# Altium project Function Generator 2.PrjPcb
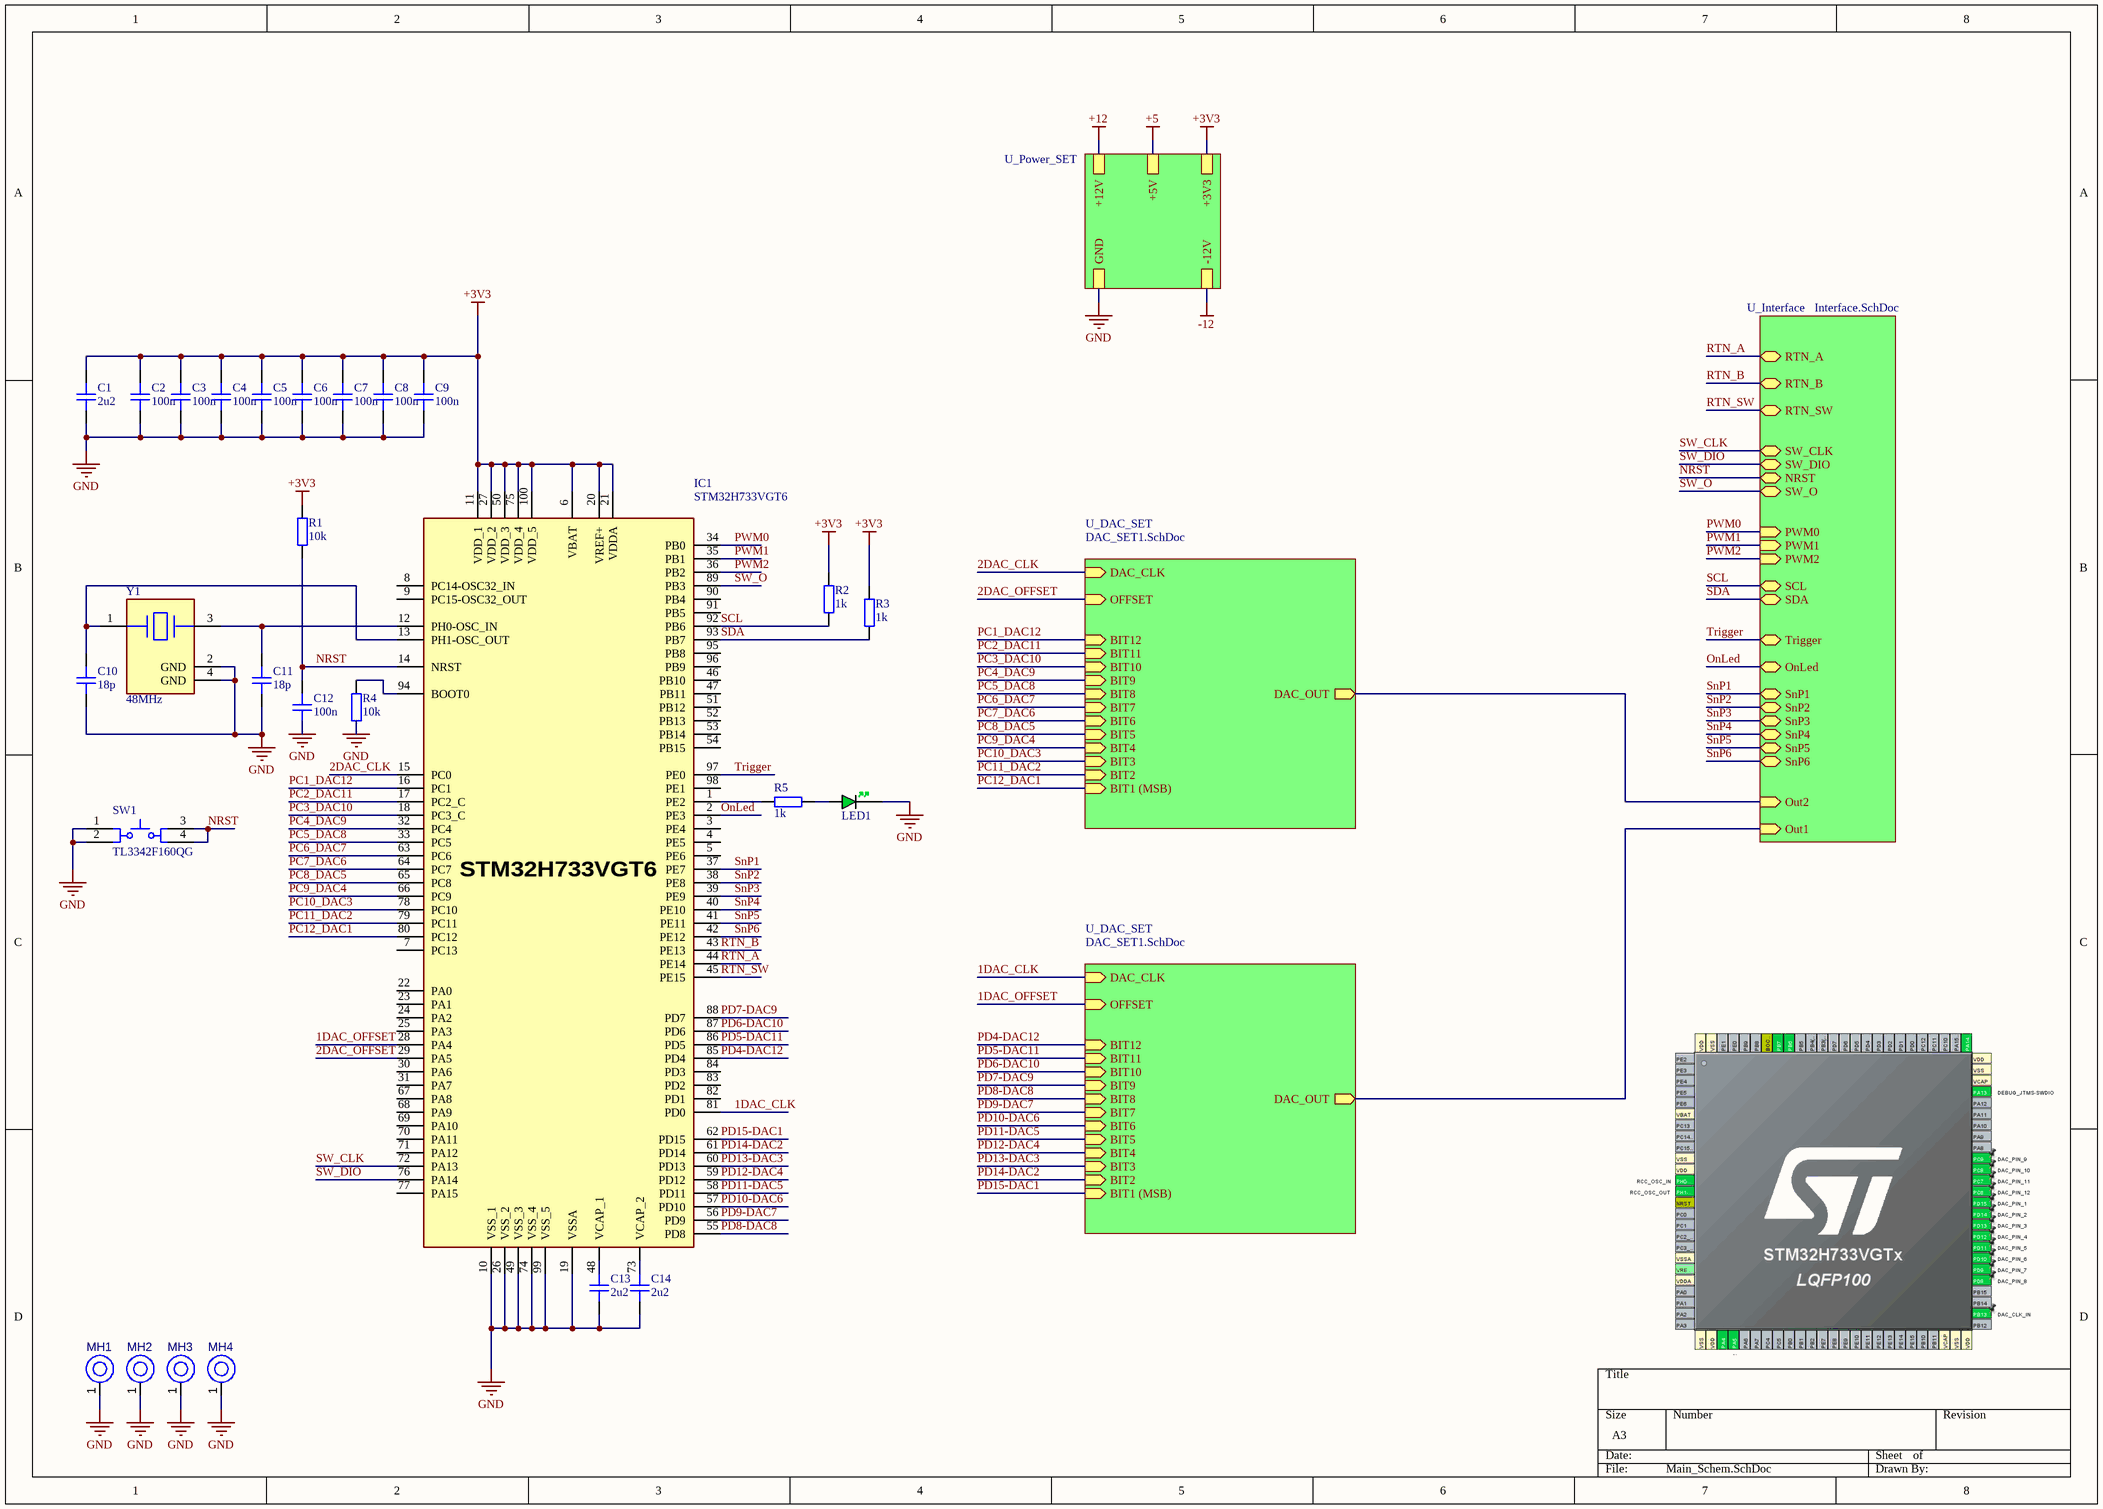
[diagram p0: Main_Schem.SchDoc]
4 sheets, 126 parts. Net scope: hierarchical (ports join the sheet entries above them; power ports are global).
Board file: PCB1.PcbDoc
Sheets:
  Main_Schem.SchDoc
    U_Power_SET = Power_SET.SchDoc
    U_DAC_SET = DAC_SET1.SchDoc
    U_Interface = Interface.SchDoc
    U_DAC_SET = DAC_SET1.SchDoc

## Sheet Main_Schem.SchDoc
size A3; SheetNumber: 1; SheetTotal: 4

### Parts
C1  2u2  [CAP_1206]
C2  100n  [CAP_0805]
C3  100n  [CAP_0805]
C4  100n  [CAP_0805]
C5  100n  [CAP_0805]
C6  100n  [CAP_0805]
C7  100n  [CAP_0805]
C8  100n  [CAP_0805]
C9  100n  [CAP_0805]
C10  18p  [CAP_0805]
C11  18p  [CAP_0805]
C12  100n  [CAP_0805]
C13  2u2  [CAP_1206]
C14  2u2  [CAP_1206]
IC1  STM32H733VGT6  [QFP50P1600X1600X160-100N]
LED1  GREEN  [LED_0805_GREEN]  (value not drawn)
R1  10k  [RES_0805]
R2  1k  [RES_0805]
R3  1k  [RES_0805]
R4  10k  [RES_0805]
R5  1k  [RES_0805]
SW1  TL3342F160QG  [ESWI-TL3342F160QG_V]
Y1  48MHz  [FP-ABM8-MFG]
ΜΗ1  PTH-M2D5X5  [PTH-M2D5X5]  (value not drawn)
ΜΗ2  PTH-M2D5X5  [PTH-M2D5X5]  (value not drawn)
ΜΗ3  PTH-M2D5X5  [PTH-M2D5X5]  (value not drawn)
ΜΗ4  PTH-M2D5X5  [PTH-M2D5X5]  (value not drawn)

### Sub-sheets
U_DAC_SET = DAC_SET1.SchDoc: BIT1 (MSB) (in), BIT2 (in), BIT3 (in), BIT4 (in), BIT5 (in), BIT6 (in), BIT7 (in), BIT8 (in), BIT9 (in), BIT10 (in), BIT11 (in), BIT12 (in), OFFSET (in), DAC_OUT (out), DAC_CLK (in)
U_DAC_SET = DAC_SET1.SchDoc: BIT1 (MSB) (in), BIT2 (in), BIT3 (in), BIT4 (in), BIT5 (in), BIT6 (in), BIT7 (in), BIT8 (in), BIT9 (in), BIT10 (in), BIT11 (in), BIT12 (in), OFFSET (in), DAC_OUT (out), DAC_CLK (in)
U_Interface = Interface.SchDoc: OnLed (bidir), Out1 (in), SnP1 (bidir), SnP2 (bidir), SnP3 (bidir), SnP4 (bidir), SnP5 (bidir), SnP6 (bidir), Trigger (bidir), SDA (bidir), SCL (bidir), Out2 (in), PWM0 (in), PWM1 (in), PWM2 (in), SW_CLK (bidir), SW_DIO (bidir), RTN_SW (bidir), RTN_B (bidir), RTN_A (bidir), NRST (bidir), SW_O (bidir)
U_Power_SET = Power_SET.SchDoc: +12V, -12V, +5V, +3V3, GND

### Nets
+3V3: C1.2 C2.2 C3.2 C4.2 C5.2 C6.2 C7.2 C8.2 C9.2 IC1.6(VBAT) IC1.11(VDD_1) IC1.20(VREF+) IC1.21(VDDA) IC1.27(VDD_2) IC1.50(VDD_3) IC1.75(VDD_4) IC1.100(VDD_5) R1.2 R2.1 R3.1 ; sheet U_Power_SET/+3V3
GND: C1.1 C2.1 C3.1 C4.1 C5.1 C6.1 C7.1 C8.1 C9.1 C10.1 C11.1 C12.1 C13.1 C14.1 IC1.10(VSS_1) IC1.19(VSSA) IC1.26(VSS_2) IC1.49(VSS_3) IC1.74(VSS_4) IC1.99(VSS_5) LED1.K R4.1 SW1.1 SW1.2 Y1.2(GND) Y1.4(GND) ΜΗ1.1(H1) ΜΗ2.1(H1) ΜΗ3.1(H1) ΜΗ4.1(H1) ; sheet U_Power_SET/GND
1DAC_CLK: IC1.81(PD0) ; sheet U_DAC_SET/DAC_CLK
1DAC_OFFSET: IC1.28(PA4) ; sheet U_DAC_SET/OFFSET
2DAC_CLK: IC1.15(PC0) ; sheet U_DAC_SET/DAC_CLK
2DAC_OFFSET: IC1.29(PA5) ; sheet U_DAC_SET/OFFSET
NRST: C12.2 IC1.14(NRST) R1.1 SW1.3 SW1.4 ; sheet U_Interface/NRST
OnLed: IC1.2(PE3) ; sheet U_Interface/OnLed  [project net LedON]
Out1: sheet U_DAC_SET/DAC_OUT, sheet U_Interface/Out1
Out2: sheet U_Interface/Out2, sheet U_DAC_SET/DAC_OUT
PC1_DAC12: IC1.16(PC1) ; sheet U_DAC_SET/BIT12
PC2_DAC11: IC1.17(PC2_C) ; sheet U_DAC_SET/BIT11
PC3_DAC10: IC1.18(PC3_C) ; sheet U_DAC_SET/BIT10
PC4_DAC9: IC1.32(PC4) ; sheet U_DAC_SET/BIT9
PC5_DAC8: IC1.33(PC5) ; sheet U_DAC_SET/BIT8
PC6_DAC7: IC1.63(PC6) ; sheet U_DAC_SET/BIT7
PC7_DAC6: IC1.64(PC7) ; sheet U_DAC_SET/BIT6
PC8_DAC5: IC1.65(PC8) ; sheet U_DAC_SET/BIT5
PC9_DAC4: IC1.66(PC9) ; sheet U_DAC_SET/BIT4
PC10_DAC3: IC1.78(PC10) ; sheet U_DAC_SET/BIT3
PC11_DAC2: IC1.79(PC11) ; sheet U_DAC_SET/BIT2
PC12_DAC1: IC1.80(PC12) ; sheet U_DAC_SET/BIT1 (MSB)
PD4-DAC12: IC1.85(PD4) ; sheet U_DAC_SET/BIT12
PD5-DAC11: IC1.86(PD5) ; sheet U_DAC_SET/BIT11
PD6-DAC10: IC1.87(PD6) ; sheet U_DAC_SET/BIT10
PD7-DAC9: IC1.88(PD7) ; sheet U_DAC_SET/BIT9
PD8-DAC8: IC1.55(PD8) ; sheet U_DAC_SET/BIT8
PD9-DAC7: IC1.56(PD9) ; sheet U_DAC_SET/BIT7
PD10-DAC6: IC1.57(PD10) ; sheet U_DAC_SET/BIT6
PD11-DAC5: IC1.58(PD11) ; sheet U_DAC_SET/BIT5
PD12-DAC4: IC1.59(PD12) ; sheet U_DAC_SET/BIT4
PD13-DAC3: IC1.60(PD13) ; sheet U_DAC_SET/BIT3
PD14-DAC2: IC1.61(PD14) ; sheet U_DAC_SET/BIT2
PD15-DAC1: IC1.62(PD15) ; sheet U_DAC_SET/BIT1 (MSB)
PWM0: IC1.34(PB0) ; sheet U_Interface/PWM0
PWM1: IC1.35(PB1) ; sheet U_Interface/PWM1
PWM2: IC1.36(PB2) ; sheet U_Interface/PWM2
RTN_A: IC1.44(PE14) ; sheet U_Interface/RTN_A
RTN_B: IC1.43(PE13) ; sheet U_Interface/RTN_B
RTN_SW: IC1.45(PE15) ; sheet U_Interface/RTN_SW
SCL: IC1.92(PB6) R2.2 ; sheet U_Interface/SCL
SDA: IC1.93(PB7) R3.2 ; sheet U_Interface/SDA
SnP1: IC1.37(PE7) ; sheet U_Interface/SnP1
SnP2: IC1.38(PE8) ; sheet U_Interface/SnP2
SnP3: IC1.39(PE9) ; sheet U_Interface/SnP3
SnP4: IC1.40(PE10) ; sheet U_Interface/SnP4
SnP5: IC1.41(PE11) ; sheet U_Interface/SnP5
SnP6: IC1.42(PE12) ; sheet U_Interface/SnP6
SW_CLK: IC1.72(PA13) ; sheet U_Interface/SW_CLK
SW_DIO: IC1.76(PA14) ; sheet U_Interface/SW_DIO
SW_O: IC1.89(PB3) ; sheet U_Interface/SW_O
Trigger: IC1.97(PE0) ; sheet U_Interface/Trigger
NetC10_2: C10.2 IC1.13(PH1-OSC_OUT) Y1.1
NetC11_2: C11.2 IC1.12(PH0-OSC_IN) Y1.3
NetC13_2: C13.2 IC1.48(VCAP_1)
NetC14_2: C14.2 IC1.73(VCAP_2)
NetIC1_1: IC1.1(PE2) R5.2
NetIC1_94: IC1.94(BOOT0) R4.2
NetLED1_A: LED1.A R5.1

Not connected (* = marked no-connect by the designer): IC1 3(PE4) 4(PE5) 5(PE6) 7(PC13) 8(PC14-OSC32_IN) 9(PC15-OSC32_OUT) 22(PA0) 23(PA1) 24(PA2) 25(PA3) 30(PA6) 31(PA7) 46(PB10) 47(PB11) 51(PB12) 52(PB13) 53(PB14) 54(PB15) 67(PA8) 68(PA9) 69(PA10) 70(PA11) 71(PA12) 77(PA15) 82(PD1) 83(PD2) 84(PD3) 90(PB4) 91(PB5) 95(PB8) 96(PB9) 98(PE1)

### Library data of the parts
C1 C13 C14 = CAP_1206: Capacitor SMD 1206; Manufacturer: *; Manufacturer Part Number: *; Distributor Link: *; LCSC: *; Rating: *; Dielectric: *
C2-C12 = CAP_0805: Capacitor SMD 0805; Manufacturer: *; Manufacturer Part Number: *; Distributor Link: *; LCSC: *; Rating: *; Dielectric: *
IC1 = CMP-020-00025-4: (550MHz), DAC
LED1 = LED_0805_GREEN: LED 0805 GREEN SMD; Manufacturer: *; Manufacturer Part Number: *; Distributor Link: *; LCSC: *
R1-R5 = RES_0805: Resistor SMD 0805; Manufacturer: *; Manufacturer Part Number: *; Distributor Link: *; LCSC: *
SW1 = CMP-011-00008-2: Tactile Switch, SPST-NO, 50 mA, 12 V, 4-Pin SMD, RoHS, Tape and Reel; Manufacturer: E-Switch; Operating Force: 1.6N; Current Rating: 50mA; Throw Configuration: SPST; Max Voltage Rating (DC): 12V; Datasheet URL: http://spec_sheets.e-switch.com/specs/P010632.pdf; Manufacturer URL: http://www.e-switch.ch/en/; Mounting Technology: SM; Case/Package: TL3342F160QG; Package Quantity: 3000; Contact Material: Silver; Package Description: 4-Pin Surface Mount Device, Body 5 x 5 mm, Pitch 6.3 mm; Package Reference: TL3342F160QG; Datasheet Version: Rev. I, 12/2010; Voltage Rating (DC): 12V; Contact Plating: Silver; RoHS Compliant: True; Packaging: TapeandReel
Y1 = CMP-27762-011708-1: Crystal 48MHz ±20ppm 18pF SMD-4 3.2mm x 2.5mm / ABM8-48.000MHZ-B2-T; Series Resistance: 35R; Frequency Stability: 50ppm; Package Quantity: 1000; Packaging: Tape and Reel; Mount: Surface Mount; Length: 3.2mm; Load Capacitance: 18pF; Max Operating Temperature: 70°C; Operating Frequency: 48 MHz; RoHS Compliant: Yes; Series: ABM8; Frequency Tolerance: 20ppm; Lead Free: Lead Free; Min Operating Temperature: -20°C; Case/Package: CSMD; Number of Pins: 4; Height: 0.031inch; ESR (Equivalent Series Resistance): 35R; Frequency: 48MHz; Radiation Hardening: No; Width: 0.098inch; Tolerance: 20ppm; Termination: SMD/SMT; Depth: 2.5mm; Resistor Type: Ceramic; REACH SVHC: No SVHC
ΜΗ1-ΜΗ4 = CMP-00028-00004-2: M2 PTH (2.5mm), 5mm pad; Pins: 1

## Sheet Power_SET.SchDoc
size A4; SheetNumber: 4; SheetTotal: 4
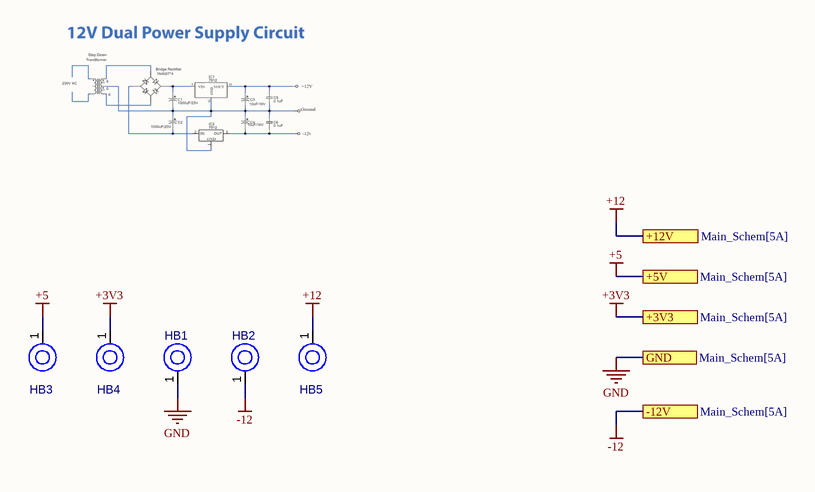
[diagram p1: Power_SET.SchDoc]

### Parts
HB1  PTH-M2D5X5  [PTH-M2D5X5]  (value not drawn)
HB2  PTH-M2D5X5  [PTH-M2D5X5]  (value not drawn)
HB3  PTH-M2D5X5  [PTH-M2D5X5]  (value not drawn)
HB4  PTH-M2D5X5  [PTH-M2D5X5]  (value not drawn)
HB5  PTH-M2D5X5  [PTH-M2D5X5]  (value not drawn)

### Ports
+3V3 (see Main_Schem[5A]), +5V (see Main_Schem[5A]), +12V (see Main_Schem[5A]), -12V (see Main_Schem[5A]), GND (see Main_Schem[5A])

### Nets
+3V3: HB4.1(H1) ; port +3V3
+5: HB3.1(H1) ; port +5V
+12: HB5.1(H1) ; port +12V
-12: HB2.1(H1) ; port -12V
GND: HB1.1(H1) ; port GND

### Library data of the parts
HB1-HB5 = CMP-00028-00004-2: M2 PTH (2.5mm), 5mm pad; Pins: 1

## Sheet DAC_SET1.SchDoc
size A4; SheetNumber: 2; SheetTotal: 4
Used 2 times, as channels U_DAC_SET, U_DAC_SET. Parts and nets are listed once, with the designators drawn on the sheet.
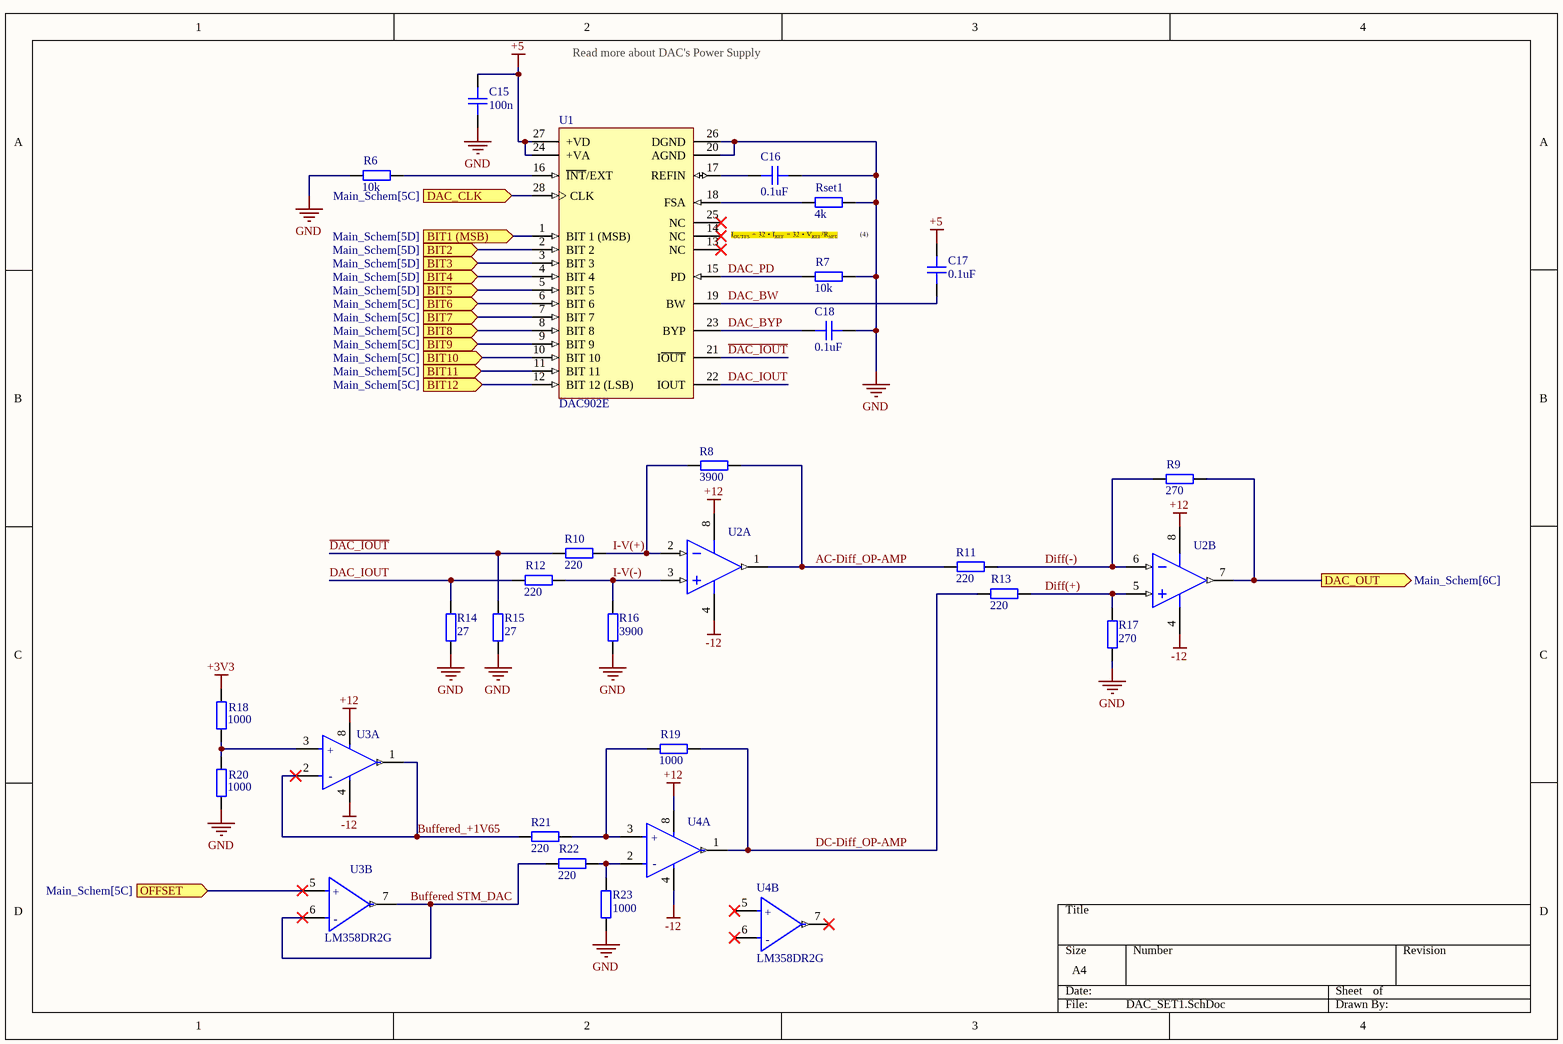
[diagram p2: DAC_SET1.SchDoc]

### Parts
C15  100n  [CAP_0805]
C16  0.1uF  [CAP_1210]
C17  0.1uF  [CAP_1210]
C18  0.1uF  [CAP_1210]
R6  10k  [RES_0805]
R7  10k  [RES_0805]
R8  3900  [RES_0805]
R9  270  [RES_0805]
R10  220  [RES_0805]
R11  220  [RES_0805]
R12  220  [RES_0805]
R13  220  [RES_0805]
R14  27  [RES_0805]
R15  27  [RES_0805]
R16  3900  [RES_0805]
R17  270  [RES_0805]
R18  1000  [RES_0805]
R19  1000  [RES_0805]
R20  1000  [RES_0805]
R21  220  [RES_0805]
R22  220  [RES_0805]
R23  1000  [RES_0805]
Rset1  4k  [RES_0805]
U1  DAC902E  [TI-PW28_L]
U2  AD8066ARZ-R7  [ADI-R-8_M]  (value not drawn)  (parts A,B of 2)
U3  LM358DR2G  [FP-751-07-IPC_C]  (value not drawn)  (parts A,B of 2)
U4  LM358DR2G  [FP-751-07-IPC_C]  (value not drawn)  (parts A,B of 2)

### Ports
BIT1 (MSB) (in, see Main_Schem[5D]), BIT2 (in, see Main_Schem[5D]), BIT3 (in, see Main_Schem[5D]), BIT4 (in, see Main_Schem[5D]), BIT5 (in, see Main_Schem[5D]), BIT6 (in, see Main_Schem[5C]), BIT7 (in, see Main_Schem[5C]), BIT8 (in, see Main_Schem[5C]), BIT9 (in, see Main_Schem[5C]), BIT10 (in, see Main_Schem[5C]), BIT11 (in, see Main_Schem[5C]), BIT12 (in, see Main_Schem[5C]), DAC_CLK (in, see Main_Schem[5C]), DAC_OUT (out, see Main_Schem[6C]), OFFSET (in, see Main_Schem[5C])

### Nets
+3V3: R18.1
+5: C15.2 C17.2 U1.24(+VA) U1.27(+VD)
+12: U2.8(+VS) U3.8(VCC) U4.8(VCC)
-12: U2.4(-VS) U3.4(VEE/GND) U4.4(VEE/GND)
GND: C15.1 C16.2 C18.2 R6.2 R7.1 R14.2 R15.2 R16.2 R17.2 R20.2 R23.2 Rset1.1 U1.20(AGND) U1.26(DGND)
~{DAC_IOUT}: R10.2 R15.1 U1.21(I~{OUT})
AC-Diff_OP-AMP: R8.2 R11.2 U2.1(VOUT_1)
BIT1 (MSB): U1.1(BIT_1_(MSB)) ; port BIT1 (MSB)
BIT2: U1.2(BIT_2) ; port BIT2
BIT3: U1.3(BIT_3) ; port BIT3
BIT4: U1.4(BIT_4) ; port BIT4
BIT5: U1.5(BIT_5) ; port BIT5
BIT6: U1.6(BIT_6) ; port BIT6
BIT7: U1.7(BIT_7) ; port BIT7
BIT8: U1.8(BIT_8) ; port BIT8
BIT9: U1.9(BIT_9) ; port BIT9
BIT10: U1.10(BIT_10) ; port BIT10
BIT11: U1.11(BIT_11) ; port BIT11
BIT12: U1.12(BIT_12_(LSB)) ; port BIT12
Buffered STM_DAC: R22.2 U3.6(INPUT_B-) U3.7(OUTPUT_B)
Buffered_+1V65: R21.2 U3.1(OUTPUT_A) U3.2(INPUT_A-)
DAC_BW: C17.1 U1.19(BW)
DAC_BYP: C18.1 U1.23(BYP)
DAC_CLK: U1.28(CLK) ; port DAC_CLK
DAC_IOUT: R12.2 R14.1 U1.22(IOUT)
DAC_OUT: R9.1 U2.7(VOUT_2) ; port DAC_OUT
DAC_PD: R7.2 U1.15(PD)
DC-Diff_OP-AMP: R13.2 R19.1 U4.1(OUTPUT_A)
Diff(+): R13.1 R17.1 U2.5(+IN_2)
Diff(-): R9.2 R11.1 U2.6(-IN_2)
I-V(+): R8.1 R10.1 U2.2(-IN_1)
I-V(-): R12.1 R16.1 U2.3(+IN_1)
OFFSET: U3.5(INPUT_B+) ; port OFFSET
NetC16_1: C16.1 U1.17(REFIN)
NetR6_1: R6.1 U1.16(~{INT}/EXT)
NetR18_2: R18.2 R20.1 U3.3(INPUT_A+)
NetR19_2: R19.2 R21.1 U4.3(INPUT_A+)
NetR22_1: R22.1 R23.1 U4.2(INPUT_A-)
NetRset1_2: Rset1.2 U1.18(FSA)

Not connected (* = marked no-connect by the designer): U1 13(NC)* 14(NC)* 25(NC)*; U4 5(INPUT_B+)* 6(INPUT_B-)* 7(OUTPUT_B)*

### Channels
U_DAC_SET: designators end in _U_DAC_SET2; ports BIT1 (MSB)=PD15-DAC1 BIT2=PD14-DAC2 BIT3=PD13-DAC3 BIT4=PD12-DAC4 BIT5=PD11-DAC5 BIT6=PD10-DAC6 BIT7=PD9-DAC7 BIT8=PD8-DAC8 BIT9=PD7-DAC9 BIT10=PD6-DAC10 BIT11=PD5-DAC11 BIT12=PD4-DAC12 DAC_CLK=1DAC_CLK DAC_OUT=Out1 OFFSET=1DAC_OFFSET
U_DAC_SET: designators end in _U_DAC_SET1; ports BIT1 (MSB)=PC12_DAC1 BIT2=PC11_DAC2 BIT3=PC10_DAC3 BIT4=PC9_DAC4 BIT5=PC8_DAC5 BIT6=PC7_DAC6 BIT7=PC6_DAC7 BIT8=PC5_DAC8 BIT9=PC4_DAC9 BIT10=PC3_DAC10 BIT11=PC2_DAC11 BIT12=PC1_DAC12 DAC_CLK=2DAC_CLK DAC_OUT=Out2 OFFSET=2DAC_OFFSET

### Notes on the sheet
- Read more about DAC's Power Supply
- (in symbol CMP-1310-00291-2, part A) +; -
- (in symbol CMP-1310-00291-2, part B) +; -

### Library data of the parts
C15 = CAP_0805: Capacitor SMD 0805; Manufacturer: *; Manufacturer Part Number: *; Distributor Link: *; LCSC: *; Rating: *; Dielectric: *
C16-C18 = CAP_1210: Capacitor SMD 1210; Manufacturer: *; Manufacturer Part Number: *; Distributor Link: *; LCSC: *; Rating: *; Dielectric: *
R6-R23 Rset1 = RES_0805: Resistor SMD 0805; Manufacturer: *; Manufacturer Part Number: *; Distributor Link: *; LCSC: *
U1 = CMP-0004-01382-1: 12-Bit, 165 MSPS SpeedPlus(TM) DAC Scalable Current Outputs between 2 to 20 mA, -40 to 85 degC, 28-pin SOP (PW28), Green (RoHS & no Sb/Br); Manufacturer: Texas Instruments; Settling Time(us): 0.03; Power Consumption(Typ)(mW): 170; SFDR(dB): 75; DNL(Max)(+/-LSB): 1.75; INL(Max)(+/-LSB): 2.5; Resolution(Bits): 12; Interface: Parallel CMOS; DAC Channels: 1; SubFamily: High Speed DAC (>10MSPS); ComponentLink3Description: Package Specification; ComponentLink2Description: Datasheet; Code_JEDEC: MO-153; Eco-Plan: Green (RoHS & no Sb/Br); Mounting Technology: Surface Mount; ComponentLink1URL: http://www.ti.com/; PackageDescription: 28-Pin Plastic Small Outline, Body 9.7 x 4.4 mm, Pitch 0.65 mm; PackageVersion: 4040064-7/G, 02/2011; ComponentLink1Description: Manufacturer URL; DatasheetVersion: SBAS094B; ComponentLink3URL: http://www.ti.com/litv/pdf/mpds364; ComponentLink2URL: http://www.ti.com/general/docs/lit/getliterature.tsp?genericPartNumber=DAC902&fileType=pdf; PackageReference: PW28; PartNumber: DAC902E
U2 = CMP-0384-01346-2: Double Channel Low Power Operational Amplifier, 145 MHz BW, 180 V/us SR, Industrial, 8-pin SOIC (R-8), Reel; Manufacturer: Analog Devices; Generic Part Number: AD8066; Small Signal Bandwidth: 145MHz; V Span Min: 5V; Input Offset Voltage: 400uV; V Span Max: 24V; Input Bias Current: 2pA; Amplifiers Per Package: 2; Iq/Amp: 7.4mA; ComponentLink1URL: http://www.analog.com/en/index.html; ComponentLink4Description: Reference Circuit; ComponentLink3URL: http://www.analog.com/static/imported-files/packages/PKG_PDF/SOIC_Narrow%20(R)/R_8.pdf; Code_JEDEC: MS-012-AA; ComponentLink3Description: Package Specification; ComponentLink4URL: http://www.analog.com/en/all-operational-amplifiers-op-amps/operational-amplifiers-op-amps/ad8066/products/product.html#product-recommendations; RevisionNote: Reference Circuit URL fixed; ComponentLink1Description: Manufacturer URL; PackageDescription: 8-Pin Standard Small Outline Package, Body 3.9 x 4.9 mm, Pitch 1.27 mm; PackageReference: R-8; Slew Rate: 180V/us; PackageVersion: 060506-A; Mounting Technology: Surface Mount; ComponentLink2Description: Datasheet; ComponentLink2URL: http://www.analog.com/static/imported-files/data_sheets/AD8065_8066.pdf; PartNumber: AD8066ARZ-R7; DatasheetVersion: Rev. J
U3 U4 = CMP-1310-00291-2: IC OPAMP GP 2 CIRCUIT 8SOIC; Gain Bandwidth Product: 1MHz; Number of Circuits: 2; Min Supply Voltage: 3V; Slew Rate: 0.6V/µs; Max Dual Supply Voltage: 16V; Common Mode Rejection Ratio: 65dB; Input Bias Current: 250nA; Min Dual Supply Voltage: 1.5V; Dual Supply Voltage: 9V; Operating Supply Current: 1.5mA; Output Current: 40mA; Input Offset Voltage (Vos): 7mV; Nominal Supply Current: 1.2mA; Voltage Gain: 100dB; Max Supply Voltage: 32V; Width: 4mm; Number of Pins: 8; Min Operating Temperature: 0°C; REACH SVHC: No SVHC; Contact Plating: Tin; Lead Free: Lead Free; Halogen Free: Halogen Free; Power Supply Rejection Ratio (PSRR): 65dB; Operating Supply Voltage: 16V; Package Quantity: 2500; Max Operating Temperature: 70°C; Case/Package: SOIC; Height: 1.5mm; Packaging: Tape and Reel; Radiation Hardening: No; Number of Channels: 2; Bandwidth: 1MHz; Length: 5mm; Number of Elements: 2; Number of Amplifiers: 2; Output Current per Channel: 40mA

## Sheet Interface.SchDoc
size A4; SheetNumber: 3; SheetTotal: 4
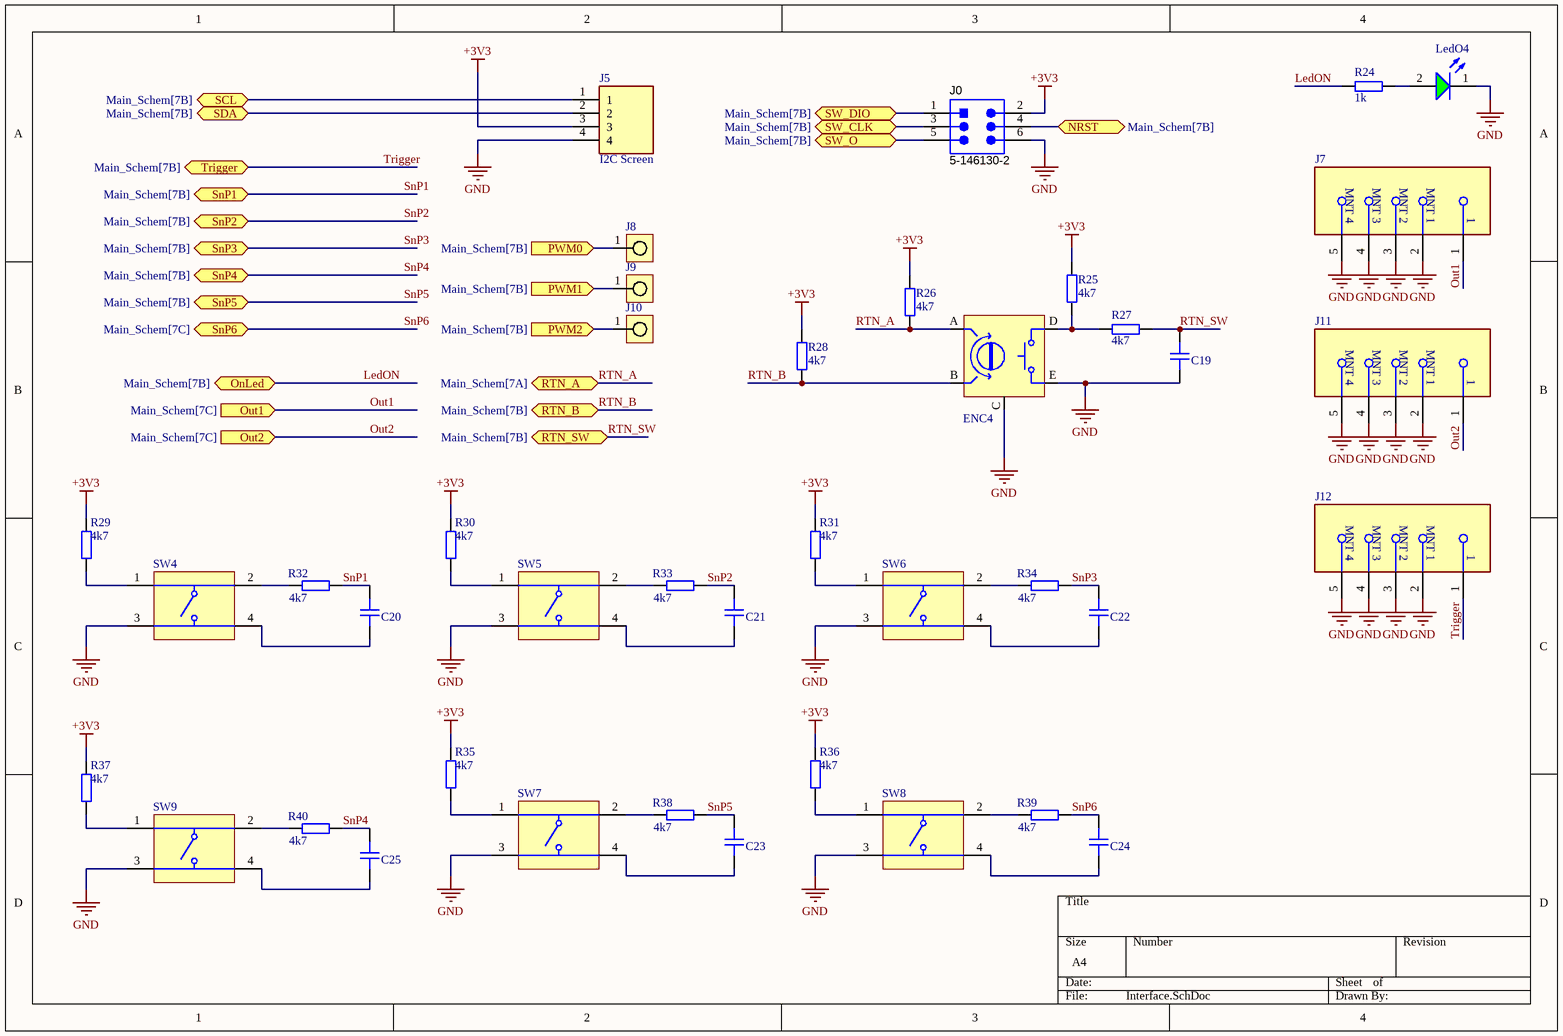
[diagram p3: Interface.SchDoc]

### Parts
C19  CAP_0805  [CAP_0805]  (value not drawn)
C20  CAP_0805  [CAP_0805]  (value not drawn)
C21  CAP_0805  [CAP_0805]  (value not drawn)
C22  CAP_0805  [CAP_0805]  (value not drawn)
C23  CAP_0805  [CAP_0805]  (value not drawn)
C24  CAP_0805  [CAP_0805]  (value not drawn)
C25  CAP_0805  [CAP_0805]  (value not drawn)
ENC4  EN11-HSM1BF20  [EN11-HSM]  (value not drawn)
J0  5-146130-2  [TECO-5-146130-2_V]
J5  I2C Screen  [RHDR4W70P0X254_1X4_1056X250X850P]
J7  1-1337445-0  [FP-1-1337445-0-MFG]  (value not drawn)
J8  SOLDER_PIN_THT  [SOLDER_PIN_THT_1_5]  (value not drawn)
J9  SOLDER_PIN_THT  [SOLDER_PIN_THT_1_5]  (value not drawn)
J10  SOLDER_PIN_THT  [SOLDER_PIN_THT_1_5]  (value not drawn)
J11  1-1337445-0  [FP-1-1337445-0-MFG]  (value not drawn)
J12  1-1337445-0  [FP-1-1337445-0-MFG]  (value not drawn)
LedO4  151053GS03000  [WL-TMRW_D5.8H11.7]  (value not drawn)
R24  1k  [RES_0805]
R25  4k7  [RES_0805]
R26  4k7  [RES_0805]
R27  4k7  [RES_0805]
R28  4k7  [RES_0805]
R29  4k7  [RES_0805]
R30  4k7  [RES_0805]
R31  4k7  [RES_0805]
R32  4k7  [RES_0805]
R33  4k7  [RES_0805]
R34  4k7  [RES_0805]
R35  4k7  [RES_0805]
R36  4k7  [RES_0805]
R37  4k7  [RES_0805]
R38  4k7  [RES_0805]
R39  4k7  [RES_0805]
R40  4k7  [RES_0805]
SW4  1825910-6  [TECO-1825910-6_V]  (value not drawn)
SW5  1825910-6  [TECO-1825910-6_V]  (value not drawn)
SW6  1825910-6  [TECO-1825910-6_V]  (value not drawn)
SW7  1825910-6  [TECO-1825910-6_V]  (value not drawn)
SW8  1825910-6  [TECO-1825910-6_V]  (value not drawn)
SW9  1825910-6  [TECO-1825910-6_V]  (value not drawn)

### Ports
NRST (bidir, see Main_Schem[7B]), OnLed (bidir, see Main_Schem[7B]), Out1 (in, see Main_Schem[7C]), Out2 (in, see Main_Schem[7C]), PWM0 (in, see Main_Schem[7B]), PWM1 (in, see Main_Schem[7B]), PWM2 (in, see Main_Schem[7B]), RTN_A (bidir, see Main_Schem[7A]), RTN_B (bidir, see Main_Schem[7B]), RTN_SW (bidir, see Main_Schem[7B]), SCL (bidir, see Main_Schem[7B]), SDA (bidir, see Main_Schem[7B]), SnP1 (bidir, see Main_Schem[7B]), SnP2 (bidir, see Main_Schem[7B]), SnP3 (bidir, see Main_Schem[7B]), SnP4 (bidir, see Main_Schem[7B]), SnP5 (bidir, see Main_Schem[7B]), SnP6 (bidir, see Main_Schem[7C]), SW_CLK (bidir, see Main_Schem[7B]), SW_DIO (bidir, see Main_Schem[7B]), SW_O (bidir, see Main_Schem[7B]), Trigger (bidir, see Main_Schem[7B])

### Nets
+3V3: J0.2 J5.3 R25.2 R26.2 R28.2 R29.2 R30.2 R31.2 R35.2 R36.2 R37.2
GND: C19.1 ENC4.C(GND) ENC4.E J0.6 J5.4 J7.2(MNT_1) J7.3(MNT_2) J7.4(MNT_3) J7.5(MNT_4) J11.2(MNT_1) J11.3(MNT_2) J11.4(MNT_3) J11.5(MNT_4) J12.2(MNT_1) J12.3(MNT_2) J12.4(MNT_3) J12.5(MNT_4) LedO4.1(K) SW4.3 SW5.3 SW6.3 SW7.3 SW8.3 SW9.3
LedON: R24.2 ; port OnLed
NRST: J0.4 ; port NRST
Out1: J7.1 ; port Out1
Out2: J11.1 ; port Out2
PWM0: J8.1 ; port PWM0
PWM1: J9.1 ; port PWM1
PWM2: J10.1 ; port PWM2
RTN_A: ENC4.A R26.1 ; port RTN_A
RTN_B: ENC4.B R28.1 ; port RTN_B
RTN_SW: C19.2 R27.1 ; port RTN_SW
SCL: J5.1 ; port SCL
SDA: J5.2 ; port SDA
SnP1: C20.2 R32.1 ; port SnP1
SnP2: C21.2 R33.1 ; port SnP2
SnP3: C22.2 R34.1 ; port SnP3
SnP4: C25.2 R40.1 ; port SnP4
SnP5: C23.2 R38.1 ; port SnP5
SnP6: C24.2 R39.1 ; port SnP6
SW_CLK: J0.3 ; port SW_CLK
SW_DIO: J0.1 ; port SW_DIO
SW_O: J0.5 ; port SW_O
Trigger: J12.1 ; port Trigger
NetC20_1: C20.1 SW4.4
NetC21_1: C21.1 SW5.4
NetC22_1: C22.1 SW6.4
NetC23_1: C23.1 SW7.4
NetC24_1: C24.1 SW8.4
NetC25_1: C25.1 SW9.4
NetENC4_D: ENC4.D R25.1 R27.2
NetLedO4_2: LedO4.2(A) R24.1
NetR29_1: R29.1 SW4.1
NetR30_1: R30.1 SW5.1
NetR31_1: R31.1 SW6.1
NetR32_2: R32.2 SW4.2
NetR33_2: R33.2 SW5.2
NetR34_2: R34.2 SW6.2
NetR35_1: R35.1 SW7.1
NetR36_1: R36.1 SW8.1
NetR37_1: R37.1 SW9.1
NetR38_2: R38.2 SW7.2
NetR39_2: R39.2 SW8.2
NetR40_2: R40.2 SW9.2

### Library data of the parts
C19-C25 = CMP-001-00086-1: Capacitor SMD 0805; Dielectric: *; Component Type: Standard; LCSC: *; Source: Kostas_Psarras_Schem_Lib.SchLib; Rating: *; Pins: 2; Distributor Link: *; Manufacturer: *; Manufacturer Part Number: *; Design Item ID: CAP_0805
ENC4 = EN11-HSM1BF20: Rotary Encoder with Switch 20 Detents 7mm Bushing 20mm Threaded Shaft Vertical; Manufacturer: TT Electronics; Manufacturer Part Number: EN11-HSM1BF20; Distributor Link: https://www.mouser.de/ProductDetail/BI-Technologies-TT-Electronics/EN11-HSM1BF20?qs=%252BUYXD5bnyXp4Uf1MU7v3zw%3D%3D
J0 = CMP-002-00018-2: Male Header, Pitch 2.54 mm, 2 x 3 Position, Height 8.13 mm, -65 to 125 degC, RoHS, Tube; Manufacturer: TE Connectivity; Max Operating Temperature: 125°C; Datasheet Version: Oct-15; Package Description: Male Header, Pitch 2.54 mm, 2 x 3 Position, Height 8.13 mm; Case/Package: 5-146130-2; Datasheet URL: http://www.te.com/commerce/DocumentDelivery/DDEController?Action=showdoc&DocId=Customer+Drawing%7F146130%7FM%7Fpdf%7FEnglish%7FENG_CD_146130_M.pdf%7F5-146130-2; Manufacturer URL: http://www.te.com/; Connector Type: Header; Gender: Male; Mounting Technology: SM; Min Operating Temperature: -65°C; RoHS Compliant: Unknown; Package Reference: 5-146130-2
J5 = CMP-002-00191-1: M20: 4 Pos Receptacle SIL Straight 3mm THT Connector 8.5mm high Tin; Manufacturer_Name: Harwin; Source: Kostas_Psarras_Schem_Lib.SchLib; Height: 8.5mm; Manufacturer_Part_Number: M20-7820446; Mouser Price/Stock: https://www.mouser.co.uk/ProductDetail/Harwin/M20-7820446?qs=vF78I%252BjhbY8%252Bno0H8mp9XA%3D%3D; Design Item ID: M20-7820446; Datasheet Link: https://content.harwin.com/m/c2ac50ebb1c800d5/original/DRG-00385-Technical-Drawing-Datasheet-M20-782-pdf.pdf; Mouser Part Number: 855-M20-7820446
J7 J11 J12 = CMP-03357-000006-1: CONN BNC JACK STR 50 OHM PCB; PCB Mount Retention: With; Operating Frequency: 0 to 4Hz; PCB Mounting Orientation: Vertical; PCB Thickness: 0.126inch; Body Plating: Silver; Frequency: 4GHz; Impedance: 50R; Insulation Resistance: 5GR; Body Material: Brass; Dielectric Material: PTFE; Gender: Female; Sealable: No (Without); Number of Positions: 1; Orientation: Straight; RoHS Compliant: Yes; Min Operating Temperature: -65°C; Packaging: Bag; Fastening Type: Bayonet; Radiation Hardening: No; Max Frequency: 4GHz; Material: Brass; Contact Plating: Silver; ELV: Compliant; Depth: 12mm; Series: BNC; Package Quantity: 50; Connector Type: BNC; Contact Material: Brass; Max Operating Temperature: 165°C; Length: 12mm; Termination: Solder; Mount: Through Hole; Insulation Material: Polytetrafluoroethylene
J8-J10 = CMP-018-000020-1: Solder Pin 1.5mm Through-Hole; Source: Kostas_Psarras_Schem_Lib.SchLib; Design Item ID: SOLDER_PIN_THT
LedO4 = CMP-1489-00005-2: NexarPartId: 29717817; Viewing Angle: 30°; Wavelength: 522nm; Max Reverse Voltage (DC): 5V; Test Current: 20mA; Forward Current: 100mA; Forward Voltage: 3.4V; Lens Style: Circular, Clear, Round; Luminous Intensity: 10cd; Lens Size: 5mm; Peak Wavelength: 515nm; Length: 5mm; Min Operating Temperature: -40°C; Color: Green; Case/Package: Radial; REACH SVHC: Unknown; Height: 8.6mm; Mount: Through Hole; Dominant Wavelength: 522nm; Max Operating Temperature: 85°C; Width: 5mm; Packaging: Bulk; RoHS: Compliant
R24 = RES_0805: Resistor SMD 0805; Manufacturer: *; Manufacturer Part Number: *; Distributor Link: *; LCSC: *
R25-R40 = CMP-009-00182-1: Resistor SMD 0805; Design Item ID: RES_0805; Pins: 2; Manufacturer: *; Manufacturer Part Number: *; Source: Kostas_Psarras_Schem_Lib.SchLib; Component Type: Standard; LCSC: *; Distributor Link: *
SW4-SW9 = CMP-1684-00021-1: Tact Switch, SPST-NO, 0.05 A, -35 to 85 degC, 4-Pin THD, RoHS, Bulk; Manufacturer: TE Connectivity; Maximum Contact Resistance: 100mOhm; Mechanical Life: 100000Cycles; Bushing Type: Unthreaded; Switch Configuration: OFF(ON); Maximum DC Voltage Rating: 24V; Contact Rating @ Voltage: 0.05A@24VDC; Actuator Color: Black; Body Orientation: Straight; Function: MomentaryContact; Illumination: N/R; Actuator Style: RoundButton; Actuator Material: PolybutyleneTerephthalate; Dielectric Strength: 500VAC; Pole Throw Configuration: SPST; Actuator Length: 1.4mm; Product Weight: N/A; Contact Material: CopperAlloy; Housing Material: N/A; Terminal Type: PCPins; Minimum Insulation Resistance: 100MOhm; Package Description: 4-Pin Through Hole Device, Body 5.99 x 5.99 mm, Pitch 6.5 mm; Part No: 1825910-6; Package Reference: THD; Base Material: N/A; Manufacturer URL: http://www.te.com; Contact Plating: Silver; RoHS: Yes; Datasheet Version: Rev. C9; Electrical Life: 100000Cycles; Maximum AC Voltage Rating: N/A; Thread Size: N/R; Operating Temperature: -35to85C; Mounting: ThroughHole; Dimension: 5.99x5mm; Datasheet URL: http://www.te.com/commerce/DocumentDelivery/DDEController?Action=showdoc&DocId=Customer+Drawing%7F1825910%7FC9%7Fpdf%7FEnglish%7FENG_CD_1825910_C9.pdf%7F1825910-6; Family: 1825910; Seal Location: N/A; Seal Description: N/A; Packaging: N/A

## Nets that join several sheets
+3V3: Main_Schem (20 pins), Power_SET (HB4.1), U_DAC_SET (R18_U_DAC_SET2.1), Interface (11 pins), U_DAC_SET (R18_U_DAC_SET1.1)
+5: Power_SET (HB3.1), U_DAC_SET (C15_U_DAC_SET2.2 C17_U_DAC_SET2.2 U1_U_DAC_SET2.24 U1_U_DAC_SET2.27), U_DAC_SET (C15_U_DAC_SET1.2 C17_U_DAC_SET1.2 U1_U_DAC_SET1.24 U1_U_DAC_SET1.27)
+12: Power_SET (HB5.1), U_DAC_SET (U2_U_DAC_SET2.8 U3_U_DAC_SET2.8 U4_U_DAC_SET2.8), U_DAC_SET (U2_U_DAC_SET1.8 U3_U_DAC_SET1.8 U4_U_DAC_SET1.8)
-12: Power_SET (HB2.1), U_DAC_SET (U2_U_DAC_SET2.4 U3_U_DAC_SET2.4 U4_U_DAC_SET2.4), U_DAC_SET (U2_U_DAC_SET1.4 U3_U_DAC_SET1.4 U4_U_DAC_SET1.4)
GND: Main_Schem (30 pins), Power_SET (HB1.1), U_DAC_SET (14 pins), Interface (24 pins), U_DAC_SET (14 pins)
1DAC_CLK: Main_Schem (IC1.81), U_DAC_SET (U1_U_DAC_SET2.28)
1DAC_OFFSET: Main_Schem (IC1.28), U_DAC_SET (U3_U_DAC_SET2.5)
2DAC_CLK: Main_Schem (IC1.15), U_DAC_SET (U1_U_DAC_SET1.28)
2DAC_OFFSET: Main_Schem (IC1.29), U_DAC_SET (U3_U_DAC_SET1.5)
LedON: Main_Schem (IC1.2), Interface (R24.2)
NRST: Main_Schem (5 pins), Interface (J0.4)
Out1: U_DAC_SET (R9_U_DAC_SET2.1 U2_U_DAC_SET2.7), Interface (J7.1)
Out2: Interface (J11.1), U_DAC_SET (R9_U_DAC_SET1.1 U2_U_DAC_SET1.7)
PC1_DAC12: Main_Schem (IC1.16), U_DAC_SET (U1_U_DAC_SET1.12)
PC2_DAC11: Main_Schem (IC1.17), U_DAC_SET (U1_U_DAC_SET1.11)
PC3_DAC10: Main_Schem (IC1.18), U_DAC_SET (U1_U_DAC_SET1.10)
PC4_DAC9: Main_Schem (IC1.32), U_DAC_SET (U1_U_DAC_SET1.9)
PC5_DAC8: Main_Schem (IC1.33), U_DAC_SET (U1_U_DAC_SET1.8)
PC6_DAC7: Main_Schem (IC1.63), U_DAC_SET (U1_U_DAC_SET1.7)
PC7_DAC6: Main_Schem (IC1.64), U_DAC_SET (U1_U_DAC_SET1.6)
PC8_DAC5: Main_Schem (IC1.65), U_DAC_SET (U1_U_DAC_SET1.5)
PC9_DAC4: Main_Schem (IC1.66), U_DAC_SET (U1_U_DAC_SET1.4)
PC10_DAC3: Main_Schem (IC1.78), U_DAC_SET (U1_U_DAC_SET1.3)
PC11_DAC2: Main_Schem (IC1.79), U_DAC_SET (U1_U_DAC_SET1.2)
PC12_DAC1: Main_Schem (IC1.80), U_DAC_SET (U1_U_DAC_SET1.1)
PD4-DAC12: Main_Schem (IC1.85), U_DAC_SET (U1_U_DAC_SET2.12)
PD5-DAC11: Main_Schem (IC1.86), U_DAC_SET (U1_U_DAC_SET2.11)
PD6-DAC10: Main_Schem (IC1.87), U_DAC_SET (U1_U_DAC_SET2.10)
PD7-DAC9: Main_Schem (IC1.88), U_DAC_SET (U1_U_DAC_SET2.9)
PD8-DAC8: Main_Schem (IC1.55), U_DAC_SET (U1_U_DAC_SET2.8)
PD9-DAC7: Main_Schem (IC1.56), U_DAC_SET (U1_U_DAC_SET2.7)
PD10-DAC6: Main_Schem (IC1.57), U_DAC_SET (U1_U_DAC_SET2.6)
PD11-DAC5: Main_Schem (IC1.58), U_DAC_SET (U1_U_DAC_SET2.5)
PD12-DAC4: Main_Schem (IC1.59), U_DAC_SET (U1_U_DAC_SET2.4)
PD13-DAC3: Main_Schem (IC1.60), U_DAC_SET (U1_U_DAC_SET2.3)
PD14-DAC2: Main_Schem (IC1.61), U_DAC_SET (U1_U_DAC_SET2.2)
PD15-DAC1: Main_Schem (IC1.62), U_DAC_SET (U1_U_DAC_SET2.1)
PWM0: Main_Schem (IC1.34), Interface (J8.1)
PWM1: Main_Schem (IC1.35), Interface (J9.1)
PWM2: Main_Schem (IC1.36), Interface (J10.1)
RTN_A: Main_Schem (IC1.44), Interface (ENC4.A R26.1)
RTN_B: Main_Schem (IC1.43), Interface (ENC4.B R28.1)
RTN_SW: Main_Schem (IC1.45), Interface (C19.2 R27.1)
SCL: Main_Schem (IC1.92 R2.2), Interface (J5.1)
SDA: Main_Schem (IC1.93 R3.2), Interface (J5.2)
SnP1: Main_Schem (IC1.37), Interface (C20.2 R32.1)
SnP2: Main_Schem (IC1.38), Interface (C21.2 R33.1)
SnP3: Main_Schem (IC1.39), Interface (C22.2 R34.1)
SnP4: Main_Schem (IC1.40), Interface (C25.2 R40.1)
SnP5: Main_Schem (IC1.41), Interface (C23.2 R38.1)
SnP6: Main_Schem (IC1.42), Interface (C24.2 R39.1)
SW_CLK: Main_Schem (IC1.72), Interface (J0.3)
SW_DIO: Main_Schem (IC1.76), Interface (J0.1)
SW_O: Main_Schem (IC1.89), Interface (J0.5)
Trigger: Main_Schem (IC1.97), Interface (J12.1)